# EAGLE design keyboard (EAGLE 6.3)
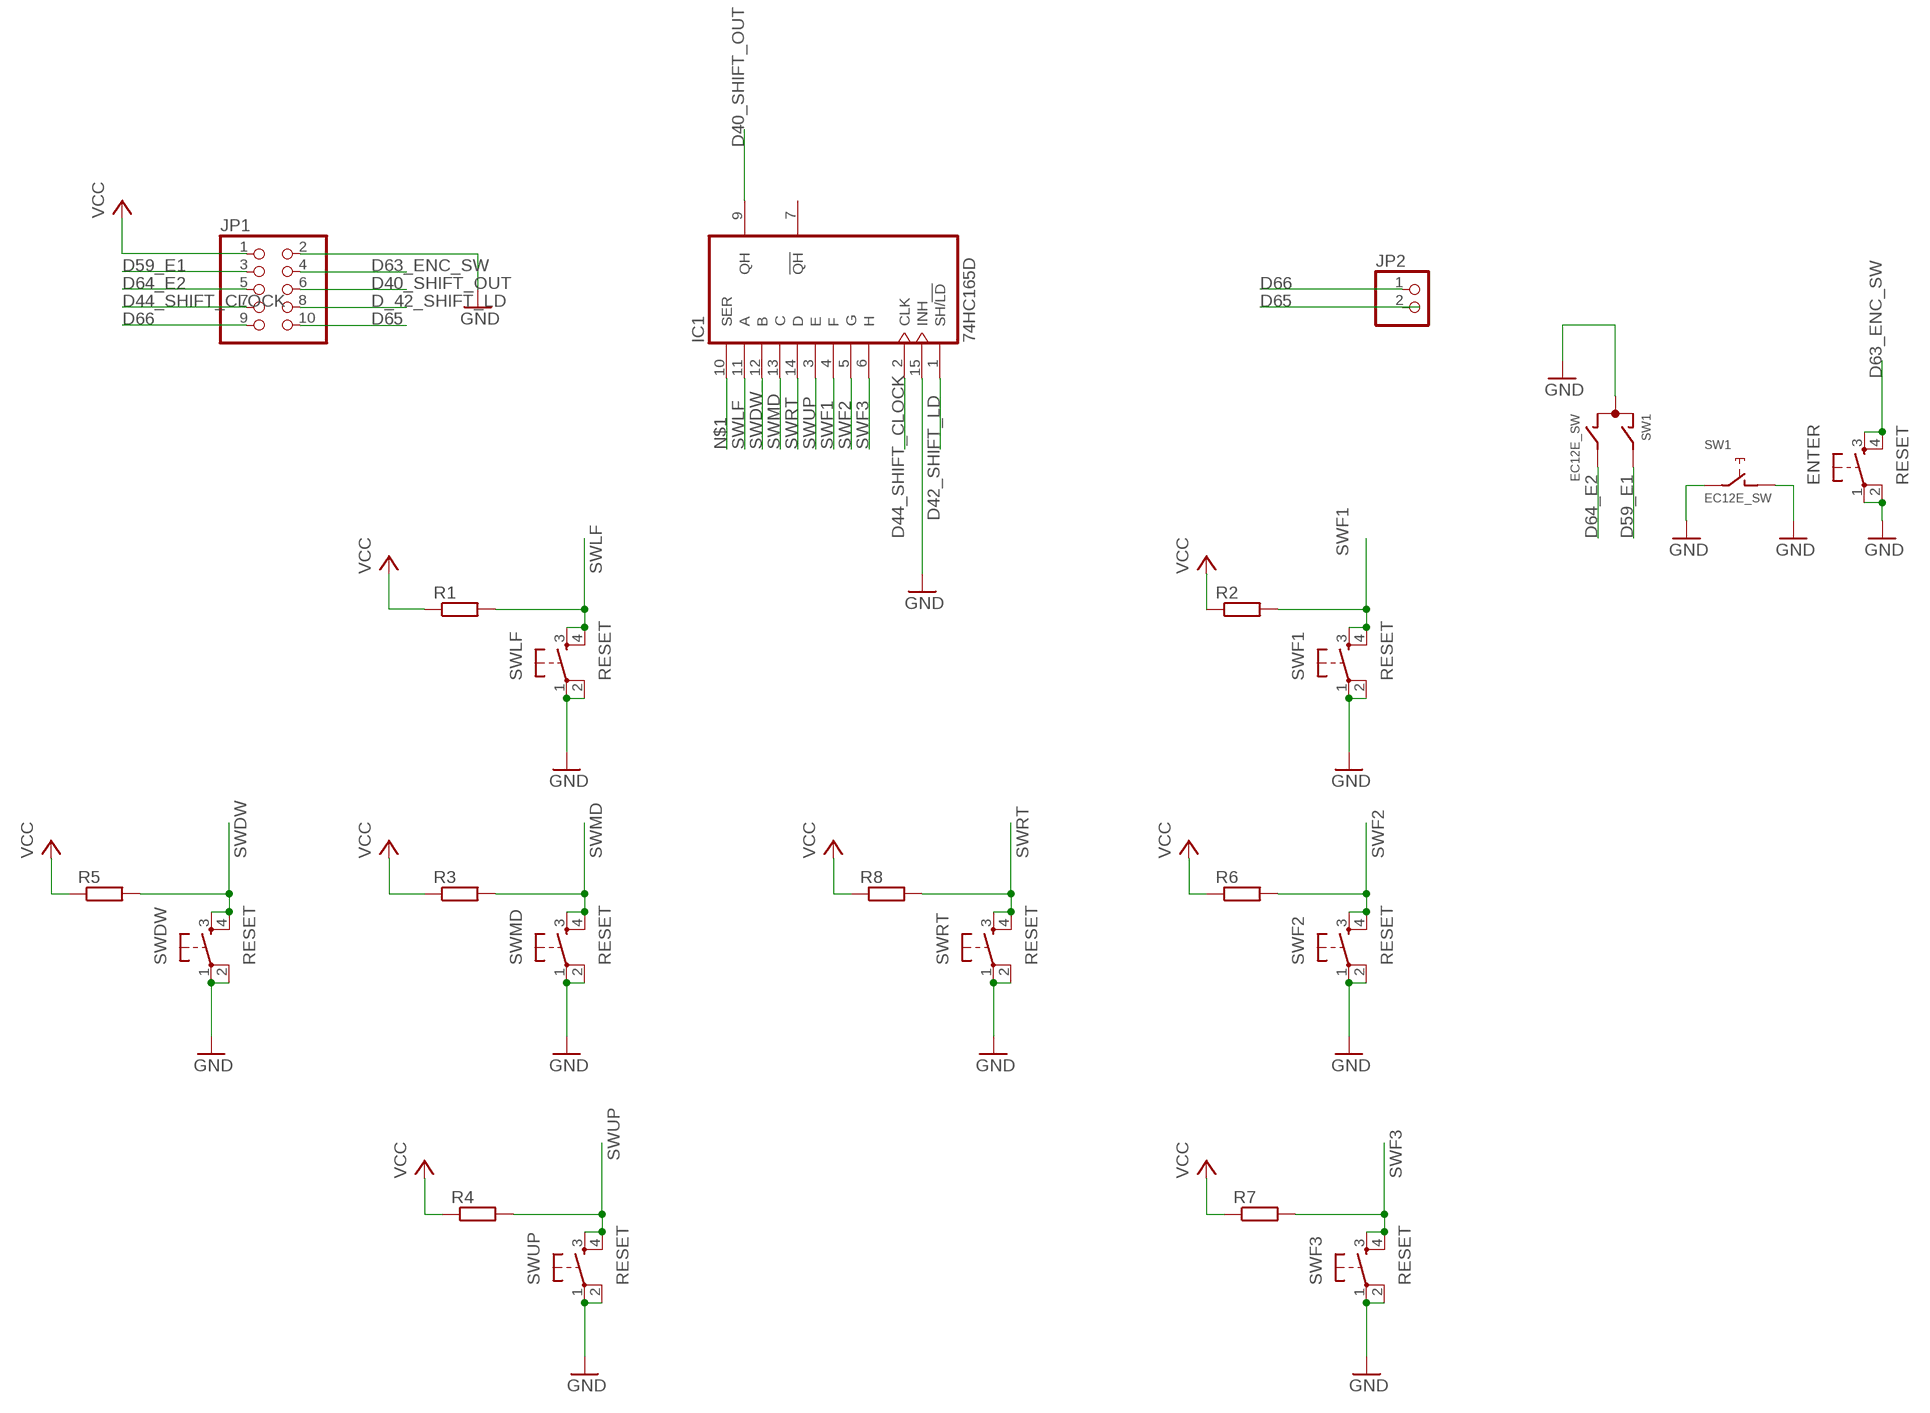
[diagram p0: schematic, sheet 1]

## Parts
ENTER  RESET  TAC_SWITCHPTH  [TACTILE-PTH]
IC1  74HC165D  [SO16]
JP1  PINHD-2X5  [2X05]
JP2  PINHD-1X2  [1X02]
R1  R-EU_R0603  [R0603]
R2  R-EU_R0603  [R0603]
R3  R-EU_R0603  [R0603]
R4  R-EU_R0603  [R0603]
R5  R-EU_R0603  [R0603]
R6  R-EU_R0603  [R0603]
R7  R-EU_R0603  [R0603]
R8  R-EU_R0603  [R0603]
SW1  EC12E_SW  [ALPS_EC12E_SW]
SWDW  RESET  TAC_SWITCHPTH  [TACTILE-PTH]
SWF1  RESET  TAC_SWITCHPTH  [TACTILE-PTH]
SWF2  RESET  TAC_SWITCHPTH  [TACTILE-PTH]
SWF3  RESET  TAC_SWITCHPTH  [TACTILE-PTH]
SWLF  RESET  TAC_SWITCHPTH  [TACTILE-PTH]
SWMD  RESET  TAC_SWITCHPTH  [TACTILE-PTH]
SWRT  RESET  TAC_SWITCHPTH  [TACTILE-PTH]
SWUP  RESET  TAC_SWITCHPTH  [TACTILE-PTH]

## Nets
D40_SHIFT_OUT: IC1.9(QH) JP1.6
D42_SHIFT_LD: IC1.1(SH/!LD)
D44_SHIFT_CLOCK: IC1.2(CLK) JP1.7
D59_E1: JP1.3 SW1.A
D63_ENC_SW: ENTER.3 ENTER.4 JP1.4
D64_E2: JP1.5 SW1.B
D65: JP1.10
D66: JP1.9 JP2.1
D_42_SHIFT_LD: JP1.8
GND [power]: ENTER.1 ENTER.2 IC1.15(INH) JP1.2 SW1.C SW1.D SW1.E SWDW.1 SWDW.2 SWF1.1 SWF1.2 SWF2.1 SWF2.2 SWF3.1 SWF3.2 SWLF.1 SWLF.2 SWMD.1 SWMD.2 SWRT.1 SWRT.2 SWUP.1 SWUP.2
N$1: IC1.10(SER)
SWDW: IC1.12(B) R5.2 SWDW.3 SWDW.4
SWF1: IC1.4(F) R2.2 SWF1.3 SWF1.4
SWF2: IC1.5(G) R6.2 SWF2.3 SWF2.4
SWF3: IC1.6(H) R7.2 SWF3.3 SWF3.4
SWLF: IC1.11(A) R1.2 SWLF.3 SWLF.4
SWMD: IC1.13(C) R3.2 SWMD.3 SWMD.4
SWRT: IC1.14(D) R8.2 SWRT.3 SWRT.4
SWUP: IC1.3(E) R4.2 SWUP.3 SWUP.4
VCC: JP1.1 R1.1 R2.1 R3.1 R4.1 R5.1 R6.1 R7.1 R8.1
Unconnected: IC1.7(!QH) JP2.2 SW1.GND1(G) SW1.GND2(G)

## Power pins joined to a net without a drawn wire
GND: IC1.8(GND)
VCC: IC1.16(VCC)

## Library data of the parts
ENTER SWDW SWF1-SWF3 SWLF SWMD SWRT SWUP = SparkFun:TAC_SWITCH: Momentary Switch Button commonly used for reset or general input. Spark Fun Electronics SKU : COM-00097
IC1 = 74xx-eu:74*165: 8-bit parallel load SHIFT REGISTER
JP1 = pinhead:PINHD-2X5: PIN HEADER
JP2 = pinhead:PINHD-1X2: PIN HEADER
R1-R8 = rcl:R-EU_: RESISTOR, European symbol
SW1 = switch-alps:EC12E_SW: ALPS rotary Encoder EC12E series with switch; MPN: EC12E2424407; OC_FARNELL: 1520813; OC_NEWARK: 74M1068

## Board
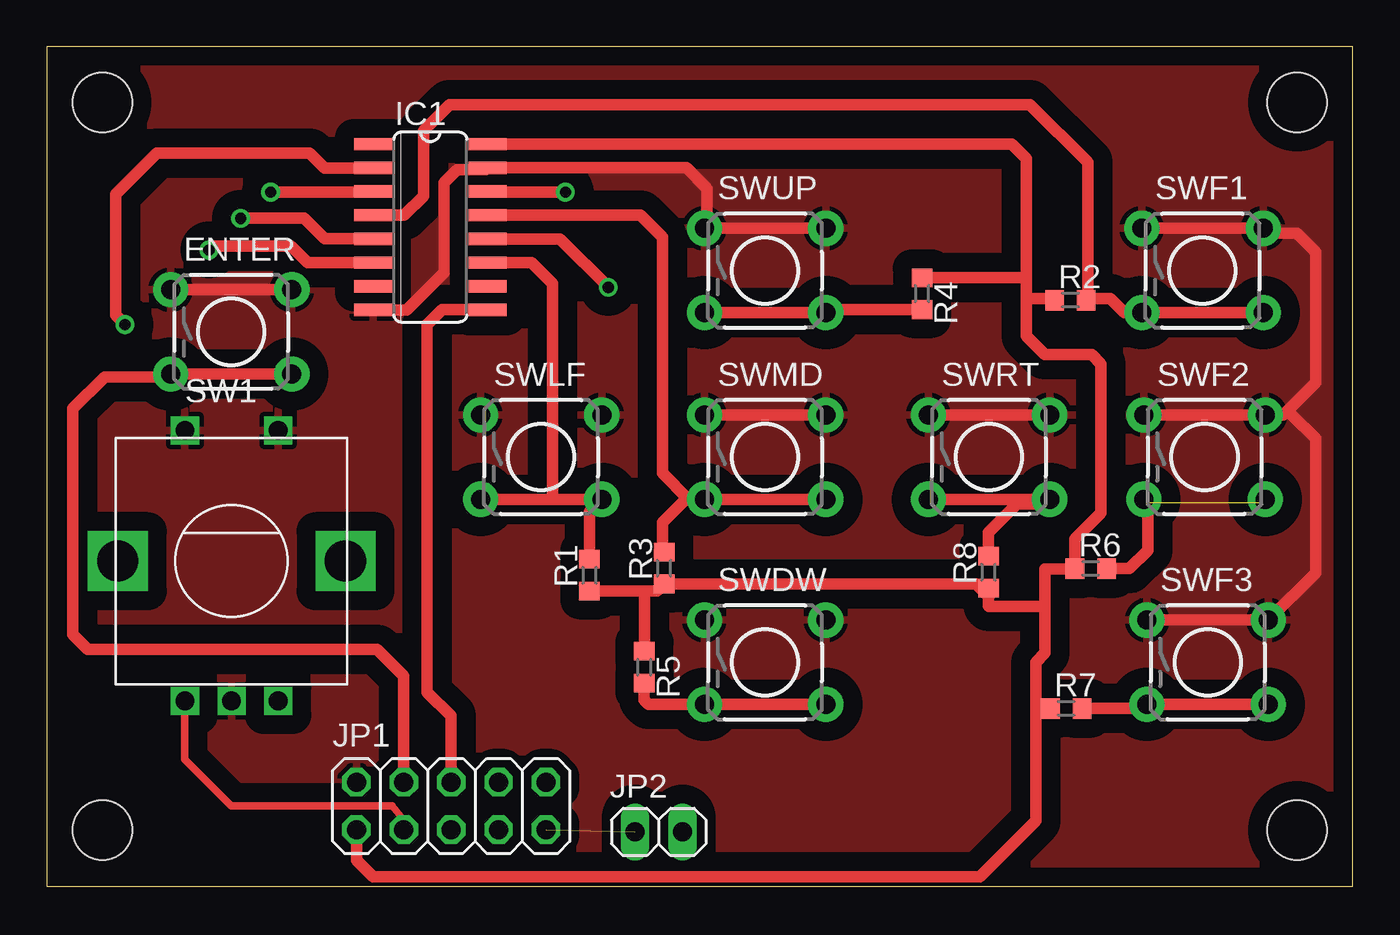
[diagram p1: board, top side]
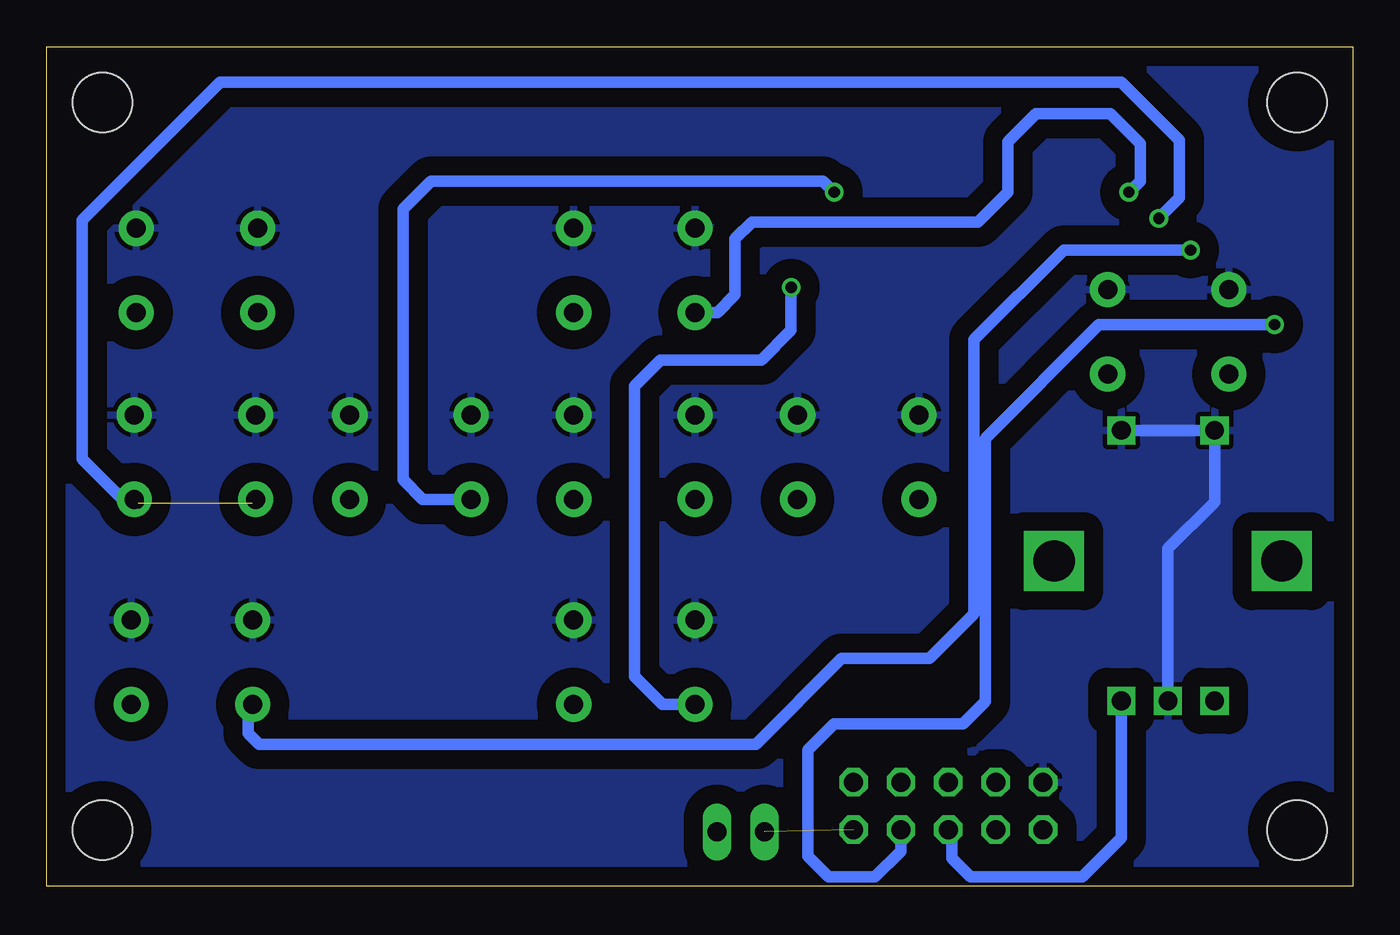
[diagram p2: board, bottom side, seen from below]

Size 70 x 45 mm. Coordinates in mm from the lower left corner, seen from the top.
Outline: 0,0 70,0 70,45 0,45 0,0
Copper layers (1*16): Top 0.035mm / dielectric 1.5mm / Bottom 0.035mm
Design rules "default": minimum track width 10mil, minimum drill 24mil, track to track 8mil, track to pad 8mil, pad to pad 8mil, via to via 8mil, smd to smd 8mil, copper to edge 40mil, drill to drill 8mil, minimum pad ring 10mil, minimum via ring 8mil, stop-mask expansion 4mil, vias tented up to drill 0mil, thermal gap 10mil
Holes 3.2 mm at 3,3 3,42 67,42 67,3

### Footprints (pad centres in the part's own frame; a part is rotated, then mirrored left to right if it is on the bottom)
TACTILE-PTH = drill 1.016 pad 1.88: 1 -3.251,2.261; 2 3.251,2.261; 3 -3.251,-2.261; 4 3.251,-2.261
SO16 = smd 0.66 x 2.032: 1 -4.445,-3.073; 2 -3.175,-3.073; 3 -1.905,-3.073; 4 -0.635,-3.073; 5 0.635,-3.073; 6 1.905,-3.073; 7 3.175,-3.073; 8 4.445,-3.073; 9 4.445,3.073; 10 3.175,3.073; 11 1.905,3.073; 12 0.635,3.073; 13 -0.635,3.073; 14 -1.905,3.073; 15 -3.175,3.073; 16 -4.445,3.073
2X05 = drill 1.016 octagon: 1 -5.08,-1.27; 2 -5.08,1.27; 3 -2.54,-1.27; 4 -2.54,1.27; 5 0,-1.27; 6 0,1.27; 7 2.54,-1.27; 8 2.54,1.27; 9 5.08,-1.27; 10 5.08,1.27
1X02 = drill 1.016 long: 1 -1.27,0; 2 1.27,0
R0603 = smd 1 x 1.1: 1 -0.85,0; 2 0.85,0
ALPS_EC12E_SW = drill 1 square: A -2.5,-7.5; B 2.5,-7.5; C 0,-7.5; D -2.5,7; E 2.5,7 | drill 2.2 square: GND1 -6.1,0; GND2 6.1,0

### Placement (x,y rotation side)
ENTER  9.89,29.71 0 top
IC1  20.56,35.33 270 top
JP1  21.68,4.3 0 top
JP2  32.8,2.91 0 top
R1  29.09,16.67 90 top
R2  54.86,31.41 0 top
R3  33.09,17.05 90 top
R4  46.91,31.76 270 top
R5  32.03,11.74 270 top
R6  55.95,17.03 0 top
R7  54.64,9.53 0 top
R8  50.47,16.83 90 top
SW1  9.91,17.43 0 top
SWDW  38.5,12 0 top
SWF1  61.94,33 0 top
SWF2  62.05,23 0 top
SWF3  62.22,12 0 top
SWLF  26.5,23 0 top
SWMD  38.5,23 0 top
SWRT  50.5,23 0 top
SWUP  38.5,33 0 top

### Tracks (layer width: path | path; a pad name or v marks a point on that pad's centre or on a via)
D40_SHIFT_OUT
  Top 0.61: JP1.6 21.68,9.12 20.4,10.4 20.4,30.1 21.2,30.9 23.62,30.9 IC1.9
D44_SHIFT_CLOCK  (via drill 0.6)
  Top 0.61: IC1.2 14.9,38.5 14.1,39.3 5.9,39.3 3.7,37.1 3.7,30.6 v4.2,30.1
  Bottom 0.61: JP1.7 24.22,1.88 25.6,0.5 28.1,0.5 29.2,1.6 29.2,7.3 27.8,8.7 20.9,8.7 19.7,9.9 19.7,24 13.6,30.1 v4.2,30.1
D59_E1
  Top 0.406: JP1.3 19.14,3.56 18.5,4.3 9.9,4.3 7.4,6.8 7.4,9.82 SW1.A
D63_ENC_SW
  Top 0.61: JP1.4 19.14,11.26 17.7,12.7 2.2,12.7 1.4,13.5 1.4,25.6 3.1,27.3 6.49,27.3 ENTER.3 ENTER.4
D64_E2
  Bottom 0.61: SW1.B 12.41,2.59 14.5,0.5 20.5,0.5 21.5,1.5 21.5,2.85 JP1.5
D66  (1 unrouted)
GND
  Top 0.61: SWMD.1 SWMD.2 | SWRT.1 SWRT.2 | SWF2.1 SWF2.2 | 66.26,25.26 68,27 68,34 67,35 65.45,35 SWF1.2 SWF1.1 | SWUP.2 SWUP.1 35.4,35.41 35.4,37.4 34.3,38.51 IC1.15 23.53,38.4 22,38.4 21.3,37.7 21.3,32.9 19.29,30.89 IC1.8 | SWF3.1 SWF3.2 68,16.79 68,24 66.74,25.26 | ENTER.1 ENTER.2
  Bottom 0.61: SW1.C 9.91,18.09 7.4,20.6 SW1.D SW1.E
  pour Bottom (isolate 1.016): 0.5,45 70,45 70,0 0,0 0,45
  pour Top (isolate 1.016): 0,0 70,0 70,45 0,45
SWDW  (via drill 0.6)
  Top 0.61: R5.2 32,10.86 32,10 32.26,9.74 SWDW.3 SWDW.4 | IC1.12 27.5,34.7 v30.1,32.1
  Bottom 0.61: v30.1,32.1 30.1,29.8 31.7,28.2 37.1,28.2 38.5,26.8 38.5,11.24 37,9.74 SWDW.3
SWF1
  Top 0.61: SWF1.4 SWF1.3 57.76,30.74 57,31.5 55.8,31.5 | IC1.4 19.16,35.97 20.2,37 20.2,40.5 21.6,41.9 52.7,41.9 55.8,38.8 55.8,31.5 | 55.8,31.5 R2.2
SWF2  (via drill 0.6)  (1 unrouted)
  Top 0.61: R6.2 58.03,17.03 59,18 59,20.54 SWF2.3 | v65.1,20.54 SWF2.4 | v10.4,35.8 13.8,35.8 14.9,34.7 IC1.5
  Bottom 0.61: v65.1,20.54 65.74,20.54 68.1,22.9 68.1,35.7 60.7,43.1 12.4,43.1 9.3,40 9.3,36.9 v10.4,35.8
SWF3  (via drill 0.6)
  Top 0.61: R7.2 58.76,9.53 SWF3.3 SWF3.4 | IC1.6 13.97,33.42 13.1,34.3 8.9,34.3 v8.7,34.1
  Bottom 0.61: v8.7,34.1 15.5,34.1 20.3,29.3 20.3,14.6 22.7,12.2 27.4,12.2 32,7.6 58.6,7.6 59.2,8.2 59.2,9.51 SWF3.3 59.1,9.87
SWLF
  Top 0.61: R1.2 29.09,20.08 SWLF.4 27,20.74 | SWLF.3 27,20.74 | IC1.11 25.98,33.42 27.1,32.3 27.1,20.84 27,20.74
SWMD
  Top 0.61: 34.4,20.74 SWMD.3 SWMD.4 | 34.4,20.74 34.24,20.74 33,19.5 33,17.99 R3.2 | IC1.13 31.84,35.97 33,34.8 33,22.14 34.4,20.74
SWRT  (via drill 0.6)
  Top 0.254: 50.8,17.78 R8.2 | 53.34,20.32 SWRT.4
  Top 0.61: R8.2 50.47,18.97 52,20.5 53.51,20.5 SWRT.4 SWRT.3 | v27.8,37.2 23.67,37.2 IC1.14
  Bottom 0.61: SWRT.3 49.84,20.74 50.9,21.8 50.9,36.3 49.4,37.8 28.4,37.8 v27.8,37.2
SWUP  (via drill 0.6)
  Top 0.61: SWUP.3 SWUP.4 41.92,30.91 R4.2 | v12,37.2 17.45,37.2 IC1.3
  Bottom 0.61: SWUP.3 34.06,30.74 33.1,31.7 33.1,34.7 32.2,35.6 20.1,35.6 18.5,37.2 18.5,39.9 17,41.4 13,41.4 11.4,39.8 11.4,37.8 v12,37.2
VCC
  Top 0.61: R1.1 32,15.82 | 32,15.82 32.71,15.82 R3.1 49.8,16.2 50.5,15.5 50.5,15.95 R8.1 50.47,15.03 50.5,15 53.5,15 | R5.1 32.03,15.79 32,15.82 | R7.1 53.03,9.53 | 53.03,9.53 53,9.5 53,3.5 50,0.5 17.5,0.5 16.6,1.4 JP1.1 | 53.5,15 53.5,17 55.07,17 R6.1 55.1,18.6 56.5,20 56.5,28 56,28.5 53.5,28.5 52.5,29.5 52.5,31.4 | 53.5,15 53.5,12.5 53,12 53,9.56 53.03,9.53 | R2.1 53.92,31.5 52.6,31.5 52.5,31.4 | 52.5,31.4 52.5,32.4 | 52.5,32.4 52.5,39 51.73,39.77 IC1.16 | R4.1 52.29,32.61 52.5,32.4